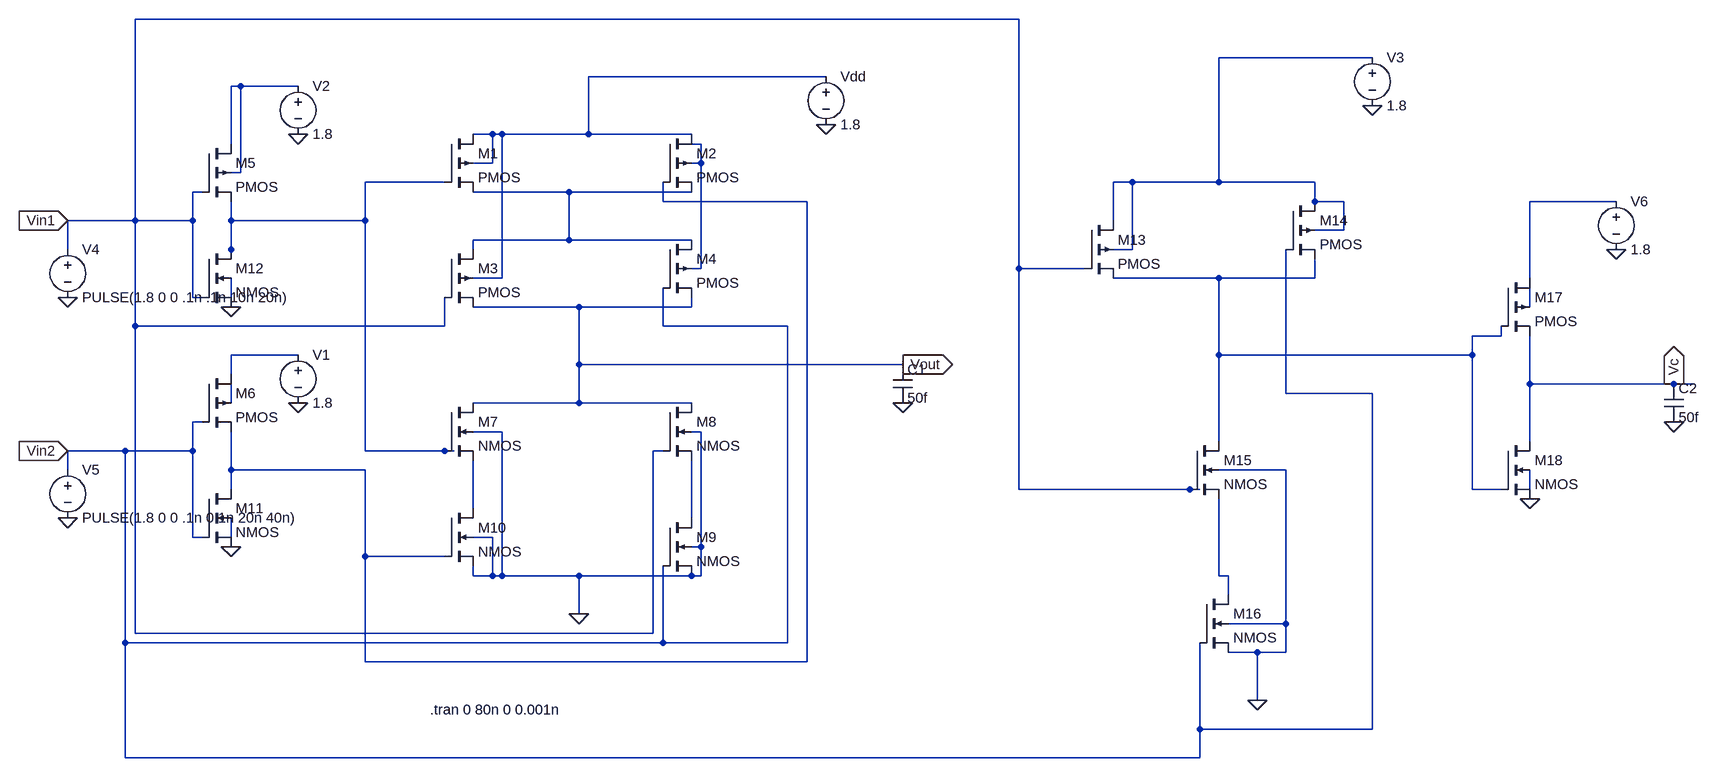
[diagram p0: schematic half_adder.asc]
half_adder.asc, the LTspice schematic file:
Version 4
SHEET 1 2856 964
WIRE 1472 -272 -560 -272
WIRE 2128 -208 1872 -208
WIRE 672 -176 256 -176
WIRE -384 -160 -400 -160
WIRE -288 -160 -384 -160
WIRE 96 -80 64 -80
WIRE 112 -80 96 -80
WIRE 256 -80 256 -176
WIRE 256 -80 112 -80
WIRE 448 -80 256 -80
WIRE -400 -64 -400 -160
WIRE 464 -64 448 -64
WIRE 96 -32 96 -80
WIRE 96 -32 64 -32
WIRE 464 -32 464 -64
WIRE 464 -32 448 -32
WIRE -384 -16 -384 -160
WIRE -384 -16 -400 -16
WIRE 16 0 -176 0
WIRE 1728 0 1696 0
WIRE 1872 0 1872 -208
WIRE 1872 0 1728 0
WIRE 2032 0 1872 0
WIRE -448 16 -464 16
WIRE 224 16 64 16
WIRE 448 16 224 16
WIRE 400 32 400 0
WIRE 640 32 400 32
WIRE 2032 32 2032 0
WIRE 2080 32 2032 32
WIRE 2688 32 2544 32
WIRE -560 64 -560 -272
WIRE -560 64 -672 64
WIRE -464 64 -464 16
WIRE -464 64 -560 64
WIRE -400 64 -400 32
WIRE -176 64 -176 0
WIRE -176 64 -400 64
WIRE 1696 64 1696 0
WIRE 2080 80 2080 32
WIRE 2080 80 2032 80
WIRE 224 96 224 16
WIRE 224 96 64 96
WIRE 448 96 224 96
WIRE -672 112 -672 64
WIRE -400 112 -400 64
WIRE 64 112 64 96
WIRE 1728 112 1728 0
WIRE 1728 112 1696 112
WIRE -400 128 -400 112
WIRE 464 144 464 -32
WIRE 464 144 448 144
WIRE 1472 144 1472 -272
WIRE 1648 144 1472 144
WIRE 112 160 112 -80
WIRE 112 160 64 160
WIRE 1872 160 1696 160
WIRE 2032 160 2032 128
WIRE 2032 160 1872 160
WIRE 2544 160 2544 32
WIRE -464 192 -464 64
WIRE -448 192 -464 192
WIRE -400 192 -400 160
WIRE 240 208 64 208
WIRE 448 208 448 192
WIRE 448 208 240 208
WIRE 2544 208 2544 176
WIRE -560 240 -560 64
WIRE 16 240 16 192
WIRE 16 240 -560 240
WIRE 400 240 400 176
WIRE 608 240 400 240
WIRE 2496 256 2496 240
WIRE 2496 256 2448 256
WIRE -288 288 -400 288
WIRE 1872 288 1872 160
WIRE 2448 288 2448 256
WIRE 2448 288 1872 288
WIRE 240 304 240 208
WIRE 800 304 240 304
WIRE -400 320 -400 288
WIRE 2544 336 2544 256
WIRE 2784 336 2544 336
WIRE 2816 336 2784 336
WIRE 1984 352 1984 112
WIRE 2128 352 1984 352
WIRE -400 368 -400 336
WIRE 240 368 240 304
WIRE 240 368 64 368
WIRE 448 368 240 368
WIRE -448 400 -464 400
WIRE 112 416 64 416
WIRE 464 416 448 416
WIRE 1872 432 1872 288
WIRE 2544 432 2544 336
WIRE -576 448 -672 448
WIRE -464 448 -464 400
WIRE -464 448 -576 448
WIRE -176 448 -176 64
WIRE 16 448 -176 448
WIRE 32 448 16 448
WIRE 400 448 384 448
WIRE -672 480 -672 448
WIRE -400 480 -400 416
WIRE -176 480 -400 480
WIRE 1984 480 1872 480
WIRE -400 512 -400 480
WIRE 1472 512 1472 144
WIRE 1824 512 1472 512
WIRE 1840 512 1824 512
WIRE 2448 512 2448 288
WIRE 2496 512 2448 512
WIRE 2544 512 2544 480
WIRE 64 544 64 464
WIRE 448 560 448 464
WIRE -464 592 -464 448
WIRE -448 592 -464 592
WIRE -400 592 -400 560
WIRE 96 592 64 592
WIRE 464 608 464 416
WIRE 464 608 448 608
WIRE -176 624 -176 480
WIRE 16 624 -176 624
WIRE 64 656 64 640
WIRE 96 656 96 592
WIRE 96 656 64 656
WIRE 112 656 112 416
WIRE 112 656 96 656
WIRE 240 656 112 656
WIRE 448 656 240 656
WIRE 464 656 464 608
WIRE 464 656 448 656
WIRE 1872 656 1872 528
WIRE 1888 656 1872 656
WIRE 1888 688 1888 656
WIRE 240 720 240 656
WIRE 1984 736 1984 480
WIRE 1984 736 1888 736
WIRE -560 752 -560 240
WIRE 384 752 384 448
WIRE 384 752 -560 752
WIRE -576 768 -576 448
WIRE 400 768 400 640
WIRE 400 768 -576 768
WIRE 608 768 608 240
WIRE 608 768 400 768
WIRE 1936 784 1888 784
WIRE 1984 784 1984 736
WIRE 1984 784 1936 784
WIRE -176 800 -176 624
WIRE 640 800 640 32
WIRE 640 800 -176 800
WIRE 1936 864 1936 784
WIRE 1840 912 1840 768
WIRE 2128 912 2128 352
WIRE 2128 912 1840 912
WIRE -576 960 -576 768
WIRE 1840 960 1840 912
WIRE 1840 960 -576 960
FLAG 240 720 0
FLAG 672 -96 0
FLAG -400 608 0
FLAG -400 208 0
FLAG -288 -80 0
FLAG -288 368 0
FLAG -672 560 0
FLAG -672 192 0
FLAG 800 368 0
FLAG 800 304 Vout
IOPIN 800 304 Out
FLAG -672 64 Vin1
IOPIN -672 64 In
FLAG -672 448 Vin2
IOPIN -672 448 In
FLAG 2128 -128 0
FLAG 1936 864 0
FLAG 2544 528 0
FLAG 2688 112 0
FLAG 2784 400 0
FLAG 2784 336 Vc
IOPIN 2784 336 Out
SYMBOL pmos4 16 -80 R0
SYMATTR InstName M1
SYMATTR Value2 l=180nm w=810nm
SYMBOL pmos4 400 -80 R0
SYMATTR InstName M2
SYMATTR Value2 l=180nm w=810nm
SYMBOL pmos4 16 112 R0
SYMATTR InstName M3
SYMATTR Value2 l=180nm w=810nm
SYMBOL pmos4 400 96 R0
SYMATTR InstName M4
SYMATTR Value2 l=180nm w=810nm
SYMBOL pmos4 -448 -64 R0
SYMATTR InstName M5
SYMATTR Value2 l=180nm w=810nm
SYMBOL pmos4 -448 320 R0
SYMATTR InstName M6
SYMATTR Value2 l=180nm w=810nm
SYMBOL nmos4 16 368 R0
SYMATTR InstName M7
SYMATTR Value2 l=180nm w=270nm
SYMBOL nmos4 400 368 R0
SYMATTR InstName M8
SYMATTR Value2 l=180nm w=270nm
SYMBOL nmos4 400 560 R0
SYMATTR InstName M9
SYMATTR Value2 l=180nm w=270nm
SYMBOL nmos4 16 544 R0
SYMATTR InstName M10
SYMATTR Value2 l=180nm w=270nm
SYMBOL nmos4 -448 512 R0
SYMATTR InstName M11
SYMATTR Value2 l=180nm w=270nm
SYMBOL nmos4 -448 112 R0
SYMATTR InstName M12
SYMATTR Value2 l=180nm w=270nm
SYMBOL voltage 672 -192 R0
WINDOW 123 0 0 Left 0
WINDOW 39 0 0 Left 0
SYMATTR InstName Vdd
SYMATTR Value 1.8
SYMBOL voltage -288 -176 R0
WINDOW 123 0 0 Left 0
WINDOW 39 0 0 Left 0
SYMATTR InstName V2
SYMATTR Value 1.8
SYMBOL voltage -672 96 R0
WINDOW 123 0 0 Left 0
WINDOW 39 0 0 Left 0
SYMATTR InstName V4
SYMATTR Value PULSE(1.8 0 0 .1n .1n 10n 20n)
SYMBOL voltage -672 464 R0
WINDOW 123 0 0 Left 0
WINDOW 39 0 0 Left 0
SYMATTR InstName V5
SYMATTR Value PULSE(1.8 0 0 .1n 0.1n 20n 40n)
SYMBOL cap 784 304 R0
SYMATTR InstName C1
SYMATTR Value 50f
SYMBOL voltage -288 272 R0
WINDOW 123 0 0 Left 0
WINDOW 39 0 0 Left 0
SYMATTR InstName V1
SYMATTR Value 1.8
SYMBOL pmos4 1648 64 R0
SYMATTR InstName M13
SYMATTR Value2 l=180n w=810n
SYMBOL pmos4 1984 32 R0
SYMATTR InstName M14
SYMATTR Value2 l=180n w=810n
SYMBOL nmos4 1824 432 R0
SYMATTR InstName M15
SYMATTR Value2 l=180n w=270n
SYMBOL nmos4 1840 688 R0
SYMATTR InstName M16
SYMATTR Value2 l=180n w=270n
SYMBOL voltage 2128 -224 R0
WINDOW 123 0 0 Left 0
WINDOW 39 0 0 Left 0
SYMATTR InstName V3
SYMATTR Value 1.8
SYMBOL pmos4 2496 160 R0
SYMATTR InstName M17
SYMATTR Value2 l=180n w=810n
SYMBOL nmos4 2496 432 R0
SYMATTR InstName M18
SYMATTR Value2 l=180n w=270n
SYMBOL voltage 2688 16 R0
WINDOW 123 0 0 Left 0
WINDOW 39 0 0 Left 0
SYMATTR InstName V6
SYMATTR Value 1.8
SYMBOL cap 2768 336 R0
SYMATTR InstName C2
SYMATTR Value 50f
TEXT -8 880 Left 2 !.tran 0 80n 0 0.001n

The netlist it stands for:
* half_adder.asc
M1 N002 N005 N006 N002 PMOS l=180nm w=810nm
M2 N002 N007 N006 N004 PMOS l=180nm w=810nm
M3 N006 Vin1 Vout N002 PMOS l=180nm w=810nm
M4 N006 Vin2 Vout N004 PMOS l=180nm w=810nm
M5 N003 Vin1 N005 N003 PMOS l=180nm w=810nm
M6 N012 Vin2 N007 N013 PMOS l=180nm w=810nm
M7 Vout N005 N015 0 NMOS l=180nm w=270nm
M8 Vout Vin1 N016 0 NMOS l=180nm w=270nm
M9 N016 Vin2 0 0 NMOS l=180nm w=270nm
M10 N015 N007 0 0 NMOS l=180nm w=270nm
M11 N007 Vin2 0 N017 NMOS l=180nm w=270nm
M12 N005 Vin1 0 N010 NMOS l=180nm w=270nm
Vdd N002 0 1.8
V2 N003 0 1.8
V4 Vin1 0 PULSE(1.8 0 0 .1n .1n 10n 20n)
V5 Vin2 0 PULSE(1.8 0 0 .1n 0.1n 20n 40n)
C1 Vout 0 50f
V1 N012 0 1.8
M13 N001 Vin1 N009 N001 PMOS l=180n w=810n
M14 N001 Vin2 N009 N001 PMOS l=180n w=810n
M15 N009 Vin1 N018 0 NMOS l=180n w=270n
M16 N018 Vin2 0 0 NMOS l=180n w=270n
V3 N001 0 1.8
M17 N008 N009 Vc N011 PMOS l=180n w=810n
M18 Vc N009 0 N014 NMOS l=180n w=270n
V6 N008 0 1.8
C2 Vc 0 50f
.model NMOS NMOS
.model PMOS PMOS
.lib standard.mos
.tran 0 80n 0 0.001n
.backanno
.end